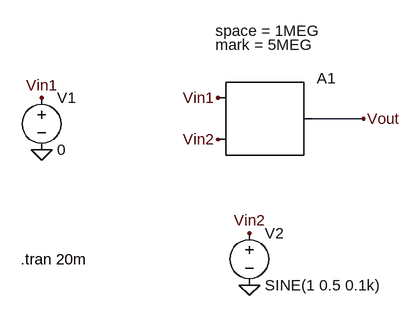
[diagram p0: schematic Εργαστήριο10επιπλέον.asc]
Εργαστήριο10επιπλέον.asc, the LTspice schematic file:
Version 4
SHEET 1 880 680
WIRE 368 144 288 144
FLAG -128 192 0
FLAG 192 400 0
FLAG -128 112 Vin1
FLAG 192 320 Vin2
FLAG 144 112 Vin1
FLAG 144 176 Vin2
FLAG 368 144 Vout
SYMBOL SpecialFunctions\\modulate 144 112 R0
WINDOW 3 -4 -82 Left 2
WINDOW 123 -4 -103 Left 2
SYMATTR InstName A1
SYMATTR Value mark = 5MEG
SYMATTR Value2 space = 1MEG
SYMBOL voltage -128 96 R0
WINDOW 123 24 124 Left 2
WINDOW 39 0 0 Left 0
SYMATTR InstName V1
SYMATTR Value 0
SYMBOL voltage 192 304 R0
WINDOW 123 0 0 Left 0
WINDOW 39 0 0 Left 0
SYMATTR InstName V2
SYMATTR Value SINE(1 0.5 0.1k)
TEXT -160 360 Left 2 !.tran 20m

The netlist it stands for:
* Εργαστήριο10επιπλέον.asc
A1 Vin1 Vin2 0 0 0 0 Vout 0 MODULATOR mark = 5MEG space = 1MEG
V1 Vin1 0 0
V2 Vin2 0 SINE(1 0.5 0.1k)
.tran 20m
.backanno
.end